# EAGLE design gatorBytes_LED_board (EAGLE 9.1.0)
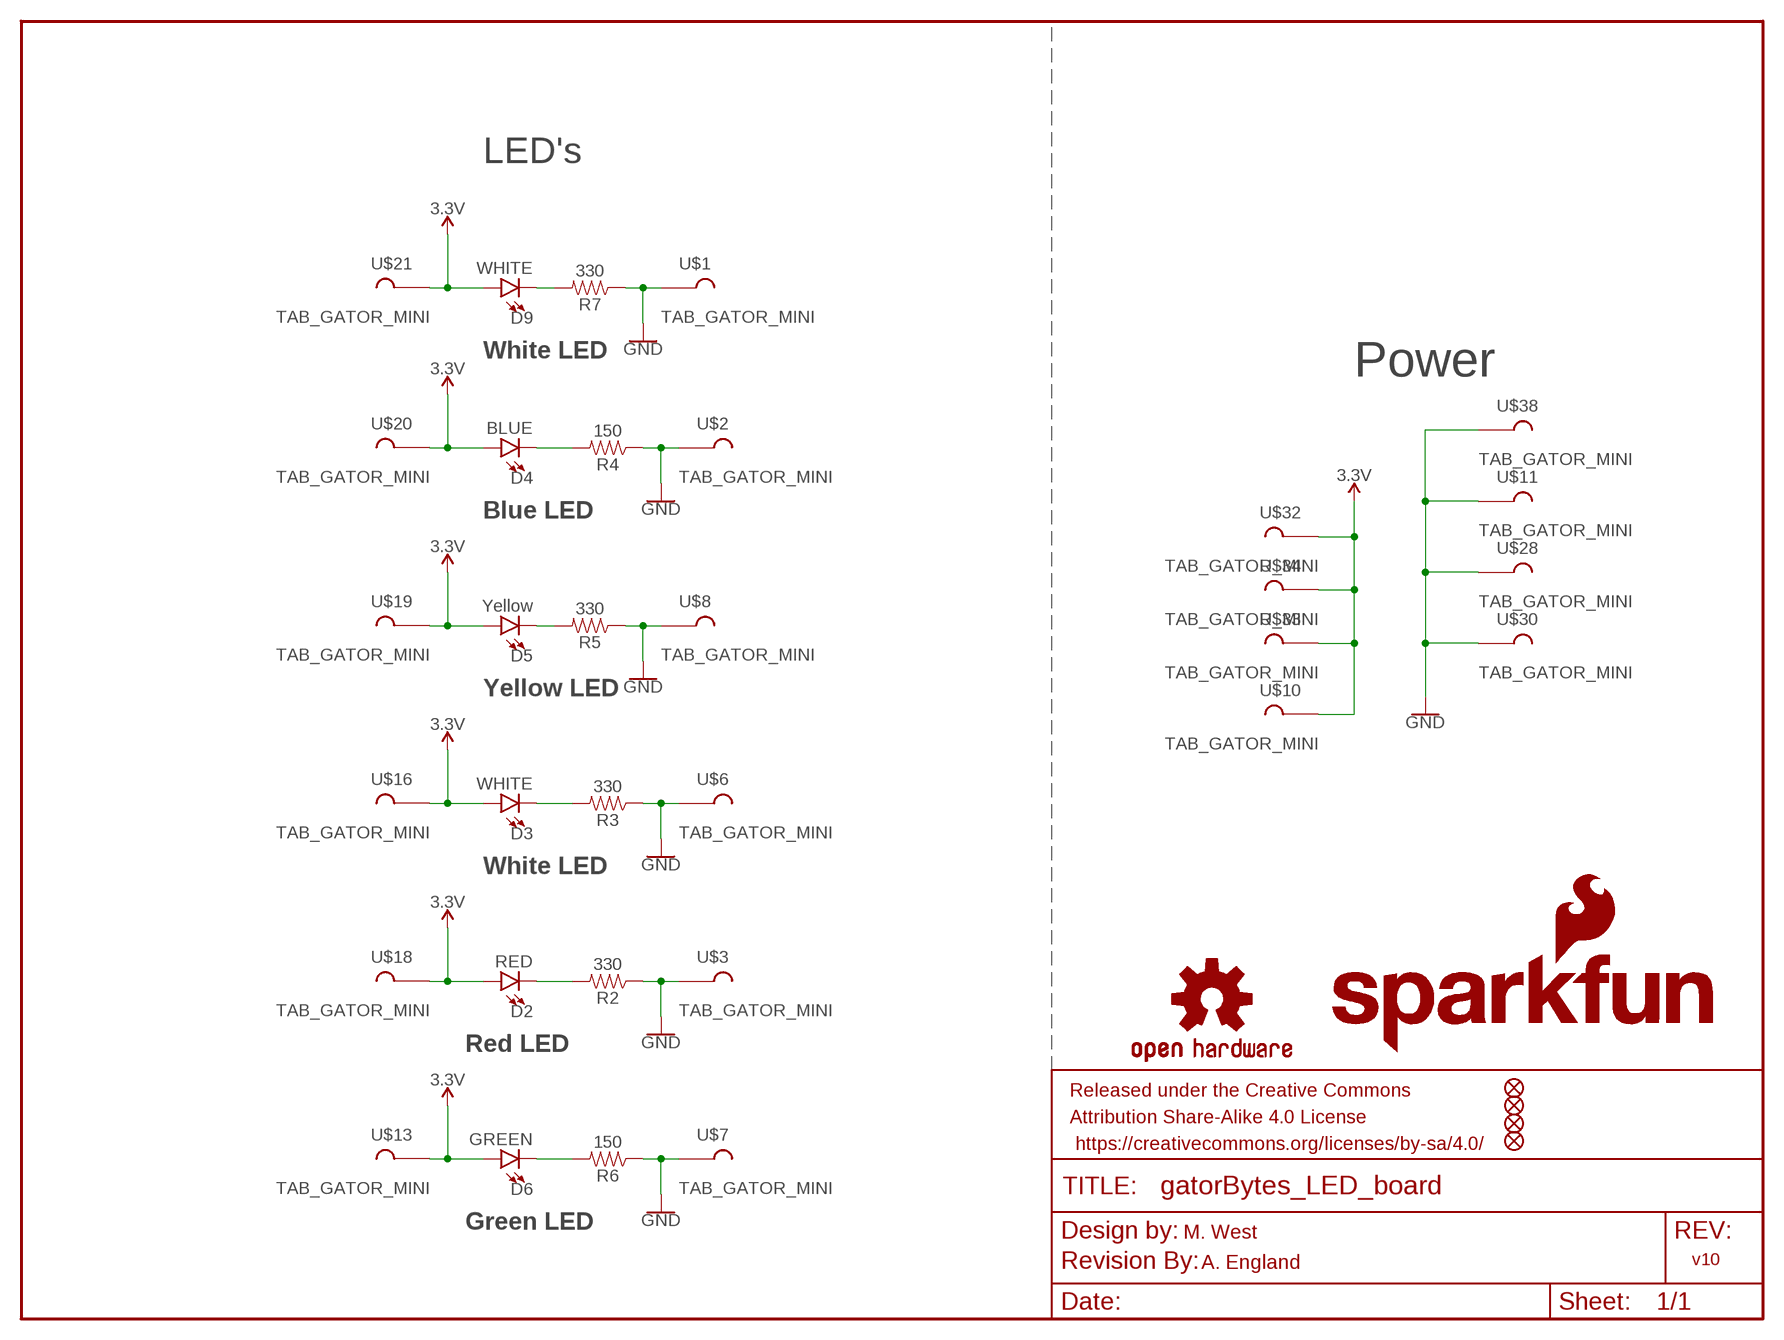
[diagram p0: schematic, sheet 1]

## Parts
D2  RED  LED-RED1206  [LED-1206]
D3  WHITE  LED-WHITE1206  [LED-1206]
D4  BLUE  LED-BLUE1206  [LED-1206]
D5  Yellow  LED-YELLOWLILYPAD  [LED-1206]
D6  GREEN  LED-GREEN1206  [LED-1206]
D9  WHITE  LED-WHITE1206  [LED-1206]
FD1  FIDUCIALUFIDUCIAL  [FIDUCIAL-MICRO]
FD2  FIDUCIALUFIDUCIAL  [FIDUCIAL-MICRO]
FD3  FIDUCIALUFIDUCIAL  [FIDUCIAL-MICRO]
FD4  FIDUCIALUFIDUCIAL  [FIDUCIAL-MICRO]
FRAME1  FRAME-LETTER  [CREATIVE_COMMONS]
LOGO1  SFE_LOGO_FLAME.1_INCH  [SFE_LOGO_FLAME_.1]
LOGO2  OSHW-LOGOMINI  [OSHW-LOGO-MINI]
LOGO8  REVISION  [REVISION]
LOGO15  OSHW-LOGOMINI  [OSHW-LOGO-MINI]
LOGO16  SFE_LOGO_NAME.1_INCH  [SFE_LOGO_NAME_.1]
R2  330  330OHM-0603-1/10W-1%  [0603]
R3  330  330OHM-0603-1/10W-1%  [0603]
R4  150  150OHM-0603-1/10W-1%  [0603]
R5  330  330OHM-0603-1/10W-1%  [0603]
R6  150  150OHM-0603-1/10W-1%  [0603]
R7  330  330OHM-0603-1/10W-1%  [0603]
U$1  TAB_GATOR_MINI  [TAB_GATOR_MINI]
U$2  TAB_GATOR_MINI  [TAB_GATOR_MINI]
U$3  TAB_GATOR_MINI  [TAB_GATOR_MINI]
U$6  TAB_GATOR_MINI  [TAB_GATOR_MINI]
U$7  TAB_GATOR_MINI  [TAB_GATOR_MINI]
U$8  TAB_GATOR_MINI  [TAB_GATOR_MINI]
U$10  TAB_GATOR_MINI  [TAB_GATOR_MINI]
U$11  TAB_GATOR_MINI  [TAB_GATOR_MINI]
U$13  TAB_GATOR_MINI  [TAB_GATOR_MINI]
U$16  TAB_GATOR_MINI  [TAB_GATOR_MINI]
U$18  TAB_GATOR_MINI  [TAB_GATOR_MINI]
U$19  TAB_GATOR_MINI  [TAB_GATOR_MINI]
U$20  TAB_GATOR_MINI  [TAB_GATOR_MINI]
U$21  TAB_GATOR_MINI  [TAB_GATOR_MINI]
U$28  TAB_GATOR_MINI  [TAB_GATOR_MINI]
U$30  TAB_GATOR_MINI  [TAB_GATOR_MINI]
U$32  TAB_GATOR_MINI  [TAB_GATOR_MINI]
U$33  TAB_GATOR_MINI  [TAB_GATOR_MINI]
U$34  TAB_GATOR_MINI  [TAB_GATOR_MINI]
U$38  TAB_GATOR_MINI  [TAB_GATOR_MINI]

## Nets
3.3V: D2.A D3.A D4.A D5.A D6.A D9.A U$10.P1 U$13.P1 U$16.P1 U$18.P1 U$19.P1 U$20.P1 U$21.P1 U$32.P1 U$33.P1 U$34.P1
GND: R2.1 R3.1 R4.1 R5.1 R6.1 R7.1 U$1.P1 U$2.P1 U$3.P1 U$6.P1 U$7.P1 U$8.P1 U$11.P1 U$28.P1 U$30.P1 U$38.P1
N$1: D2.C R2.2
N$3: D3.C R3.2
N$4: D4.C R4.2
N$5: D5.C R5.2
N$6: D6.C R6.2
N$7: D9.C R7.2

## Notes on the sheet
- LED's
- White LED
- Power
- Blue LED
- Yellow LED
- White LED
- Red LED
- Green LED
- M. West
- A. England | v10

## Library data of the parts
D2 = SparkFun-LED:LED-RED: Red SMD LED Used in manufacturing of most products at SparkFun Packages: 0603 - SMD 0603 package [Product Link] <http://docs.avagotech.com/docs/AV02-0551EN> 0603 SMART - SMD 0603 SMART package ( more efficient and expensive)[Product Link] <http://www.osram-os.com/Graphics/XPic2/00077099_0.pdf> 1206 - SMD1206 package [Product Link] <https://www.sparkfun.com/datasheets/DevTools/LilyPad/Q150OVS4.pdff> SparkFun Products: Pro Mini 328 -5V <https://www.sparkfun.com/products/821> RedBoard <https://www.sparkfun.com/products/12757> IOIO-OTG <https://www.sparkfun.com/products/13613>; PROD_ID: DIO-09912
D3 D9 = SparkFun-LED:LED-WHITE: White SMD LED Used in manufacturing several products at SparkFun. Packages: 0603 - Bright White SMD 0603 package[Product Link] <http://www.kingbrightusa.com/product.asp?catalog_name=LED&product_id=APT1608QWF/D> 1206 - Bright White SMD1206 package [Product Link] <http://www.kingbrightusa.com/product.asp?catalog_name=LED&product_id=APT3216QWF/D> 3014 - Super Bright SMD 3014 package [Datasheet] <http://www.lumileds.com/uploads/459/DS208-pdf> SparkFun Products: Blackberry Trackballer Breakout <https://www.sparkfun.com/products/13169> Digital SandBox <https://www.sparkfun.com/products/12651>; PROD_ID: DIO-09955
D4 = SparkFun-LED:LED-BLUE: Blue SMD LED Used in manufacturing of various products at SparkFun Packages: 0603 - SMD 0603 package [Product Link] <http://www.digikey.com/product-detail/en/SMLE12BC7TT86/511-1589-2-ND/1641808> 1206 - SMD1206 package [Product Link] <http://www.digikey.com/product-detail/en/lite-on-inc/LTST-C150TBKT/160-1643-1-ND/573584> SparkFun Products: ESP8266 Thing-Dev Board <https://www.sparkfun.com/products/13711> RedBoard <https://www.sparkfun.com/products/12757>; PROD_ID: DIO-09911
D5 = SparkFun-LED:LED-YELLOW: Yellow SMD LED Used in manufacturing several products at SparkFun. Packages: 0603 - SMD 0603 package[Product Link] <http://www.kingbrightusa.com/product.asp?catalog_name=LED&product_id=APT1608SYCK> 0603 -SMART - SMART SMD 0603 package (more efficient/more expensive) [Product Link] <http://www.osram-os.com/osram_os/en/products/product-catalog/led-light-emitting-diodes/smartled-0603/ly-l29k/index.jsp> LilyPad - SMD1206 package[Product Datasheet] <https://www.sparkfun.com/datasheets/DevTools/LilyPad/Q150YUS4.pdf> SparkFun Products: Blynk Board <https://www.sparkfun.com/products/13794> IOIO-OTG <https://www.sparkfun.com/products/13613> XBee Explorer Serial <https://www.sparkfun.com/products/13225>; PROD_ID: DIO-09909
D6 = SparkFun-LED:LED-GREEN: Green SMD LED Used in manufacturing of various products at SparkFun Packages: 0603 - SMD 0603 package [Product Link] <http://www.futureelectronics.com/en/technologies/semiconductors/optoelectronics/leds/Pages/9894312-LTST-C190GKT.aspx?CrossPart=HSMG-C190&IM=0> LilyPad 1206 - SMD1206 LilyPad package [Product Link] <http://www.futureelectronics.com/en/Technologies/Product.aspx?ProductID=IN150NGHARVATEKCORPORATION2049943&IM=0> 1206 - SMD1206 package [Product Link] <http://www.futureelectronics.com/en/technologies/semiconductors/optoelectronics/leds/Pages/8315665-LTST-C150KGKT.aspx?IM=0> 1206 Bottom Mount -SMD 1206 Bottom Mount [Product Link] <http://www.digikey.com/product-detail/en/lite-on-inc/LTST-C230KGKT/160-1456-1-ND/386854> SparkFun Products: Pro Mini 328 -5V <https://www.sparkfun.com/products/821> RedBoard <https://www.sparkfun.com/products/12757> MP3 Trigger <https://www.sparkfun.com/products/13720> Makey Makey <https://www.sparkfun.com/products/11076>; PROD_ID: DIO-00862
FD1-FD4 = SparkFun-Aesthetics:FIDUCIAL: Fiducial Alignment Points Point-of-reference for pick-and-place machines and other optical instruments.
FRAME1 = SparkFun-Aesthetics:FRAME-LETTER: Schematic Frame - Letter Standard 8.5x11 US Letter frame
LOGO1 = SparkFun-Aesthetics:SFE_LOGO_FLAME: SparkFun Flame Logo This is the SparkFun flame logo. The logo on the schematic will always be the same size; the package variant is the height of the flame. Default layer for the logo on the board is tSilk.
LOGO2 LOGO15 = SparkFun-Aesthetics:OSHW-LOGO: Open-Source Hardware (OSHW) Logo This logo indicates the piece of hardware it is found on incorporates a OSHW license and/or adheres to the definition of open source hardware found here: http://freedomdefined.org/OSHW
LOGO8 = SparkFun-Aesthetics:REVISION: "Revision By" Text Preceding text for revisor documentation. Includes schematic text on "symbols" layer, and board text on tDoc.
LOGO16 = SparkFun-Aesthetics:SFE_LOGO_NAME: SparkFun Font Logo This is the SparkFun name logo. The logo on the schematic will always be the same size; the package variant is the height of the flame part of the logo (or the height the flame would be, if it were drawn). Default layer for the logo on the board is tSilk.
R2 R3 R5 R7 = SparkFun-Resistors:330OHM: 330Ω resistor A resistor is a passive two-terminal electrical component that implements electrical resistance as a circuit element. Resistors act to reduce current flow, and, at the same time, act to lower voltage levels within circuits. - Wikipedia; PROD_ID: RES-00818
R4 R6 = SparkFun-Resistors:150OHM: 150Ω resistor A resistor is a passive two-terminal electrical component that implements electrical resistance as a circuit element. Resistors act to reduce current flow, and, at the same time, act to lower voltage levels within circuits. - Wikipedia; PROD_ID: RES-11028
U$1-U$3 U$6-U$8 U$10 U$11 U$13 U$16 U$18-U$21 U$28 U$30 U$32-U$34 U$38 = SparkFun-Connectors:TAB_GATOR_MINI

## Board
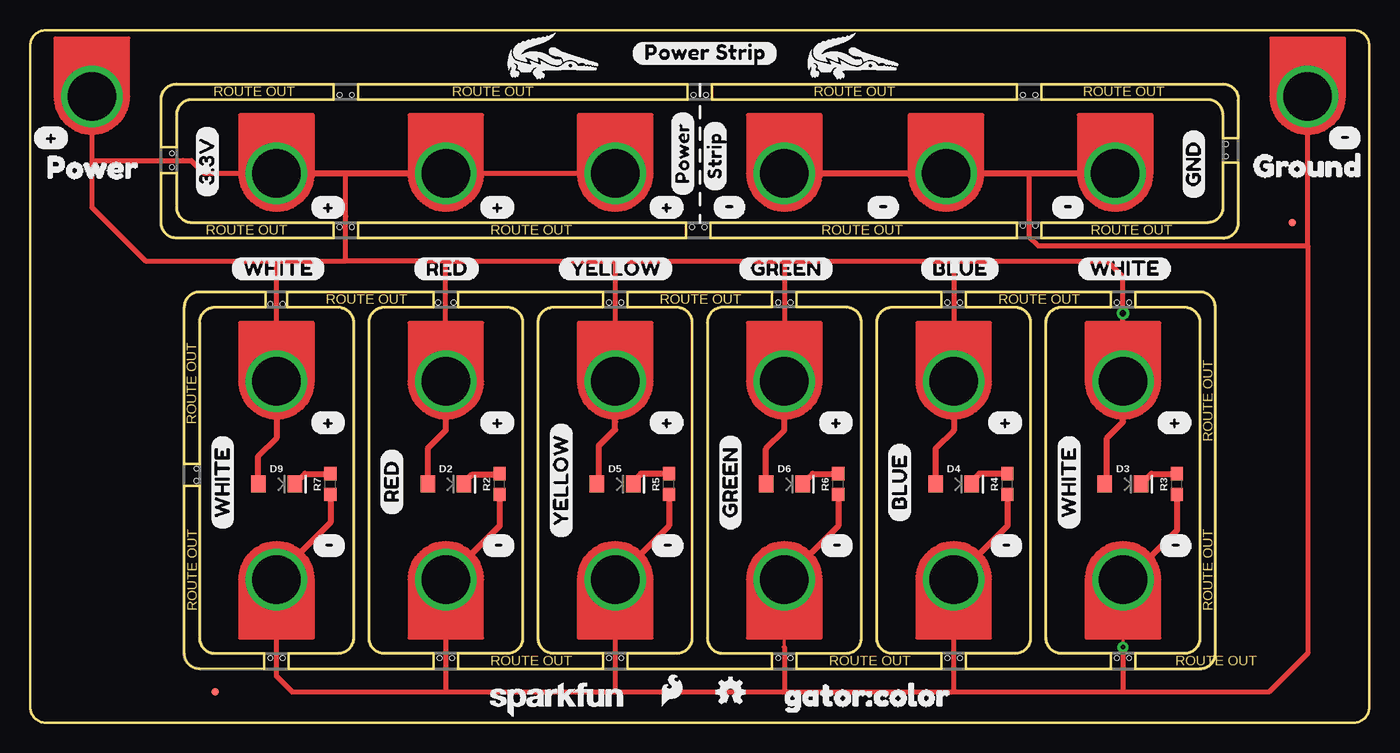
[diagram p1: board, top side]
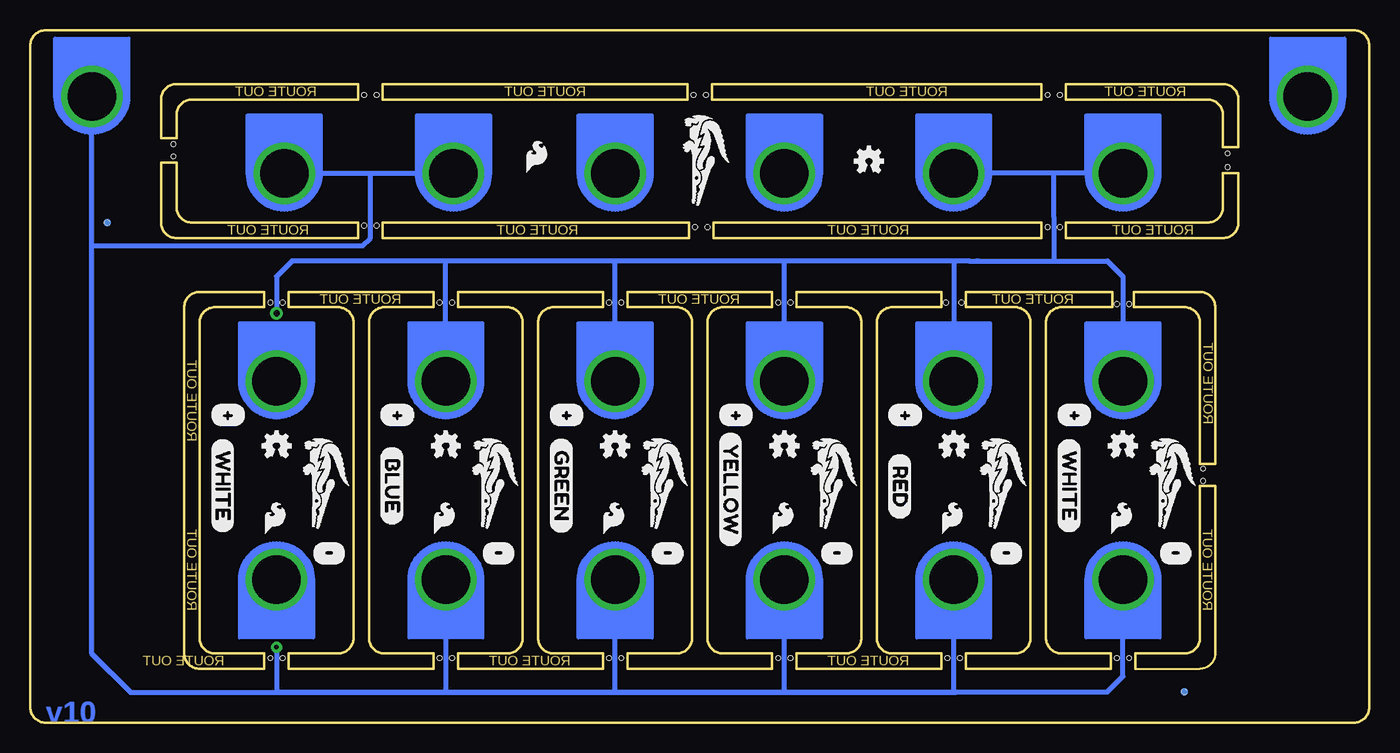
[diagram p2: board, bottom side, seen from below]

Size 110.49 x 57.15 mm. Coordinates in mm from the lower left corner, seen from the top.
Outline: 15.24,5.71 arc-90 13.97,6.99 13.97,19.56 12.7,19.56 12.7,5.71 arc90 13.97,4.45 19.3,4.45 19.3,5.71 15.24,5.71
Outline: 13.97,33.02 arc-90 15.24,34.29 19.43,34.29 19.43,35.56 13.97,35.56 arc90 12.7,34.29 12.7,21.34 13.97,21.34 13.97,33.02
Outline: 21.34,5.71 21.34,4.45 33.27,4.45 33.27,5.71 29.21,5.71 arc-90 27.94,6.99 27.94,33.02 arc-90 29.21,34.29 33.27,34.29 33.27,35.56 21.21,35.56 21.21,34.29 25.4,34.29 arc-90 26.67,33.02 26.67,6.99 arc-90 25.4,5.71 21.34,5.71
Outline: 0,1.27 0,55.88 arc-90 1.27,57.15 109.22,57.15 arc-90 110.49,55.88 110.49,1.27 arc-90 109.22,0 1.27,0 arc-90 0,1.27
Outline: 98.42,42.55 arc-90 97.16,41.27 83.44,41.27 83.44,40.01 98.42,40.01 arc90 99.69,41.27 99.69,46.23 98.42,46.23 98.42,42.55
Outline: 13.34,41.27 arc-90 12.06,42.55 12.06,45.34 10.79,45.34 10.79,41.27 arc90 12.06,40.01 25.02,40.01 25.02,41.27 13.34,41.27
Outline: 97.79,34.29 arc90 96.52,35.56 91.19,35.56 91.19,34.29 95.25,34.29 arc-90 96.52,33.02 96.52,6.99 arc-90 95.25,5.71 91.19,5.71 91.19,4.45 96.52,4.45 arc90 97.79,5.71 97.79,34.29
Outline: 35.31,5.71 35.31,4.45 47.24,4.45 47.24,5.71 43.18,5.71 arc-90 41.91,6.99 41.91,33.02 arc-90 43.18,34.29 47.24,34.29 47.24,35.56 35.31,35.56 35.31,34.29 39.37,34.29 arc-90 40.64,33.02 40.64,6.99 arc-90 39.37,5.71 35.31,5.71
Outline: 49.28,5.71 49.28,4.45 61.21,4.45 61.21,5.71 57.15,5.71 arc-90 55.88,6.99 55.88,33.02 arc-90 57.15,34.29 61.21,34.29 61.21,35.56 49.28,35.56 49.28,34.29 53.34,34.29 arc-90 54.61,33.02 54.61,6.99 arc-90 53.34,5.71 49.28,5.71
Outline: 63.25,5.71 63.25,4.45 75.18,4.45 75.18,5.71 71.12,5.71 arc-90 69.85,6.99 69.85,33.02 arc-90 71.12,34.29 75.18,34.29 75.18,35.56 63.25,35.56 63.25,34.29 67.31,34.29 arc-90 68.58,33.02 68.58,6.99 arc-90 67.31,5.71 63.25,5.71
Outline: 77.22,5.71 77.22,4.45 89.15,4.45 89.15,5.71 85.09,5.71 arc-90 83.82,6.99 83.82,33.02 arc-90 85.09,34.29 89.15,34.29 89.15,35.56 77.22,35.56 77.22,34.29 81.28,34.29 arc-90 82.55,33.02 82.55,6.99 arc-90 81.28,5.71 77.22,5.71
Outline: 27.05,41.27 27.05,40.01 54.1,40.01 54.1,41.27 27.05,41.27
Outline: 56.13,41.27 56.13,40.01 81.41,40.01 81.41,41.27 56.13,41.27
Outline: 10.79,47.5 12.06,47.5 12.06,50.16 arc-90 13.34,51.44 25.02,51.44 25.02,52.7 12.06,52.7 arc90 10.79,51.44 10.79,47.5
Outline: 27.05,51.44 27.05,52.7 54.23,52.7 54.23,51.44 27.05,51.44
Outline: 56.26,51.44 56.26,52.7 81.41,52.7 81.41,51.44 56.26,51.44
Outline: 83.44,51.44 83.44,52.7 98.42,52.7 arc-90 99.69,51.44 99.69,48.26 98.42,48.26 98.42,50.16 arc90 97.16,51.44 83.44,51.44
Copper layers (1*16): Top 0.035mm / dielectric 1.5mm / Bottom 0.035mm
Design rules "SparkFun-2-layer-STANDARD": minimum track width 10mil, minimum drill 20mil, track to track 10mil, track to pad 8mil, pad to pad 8mil, via to via 10mil, smd to smd 8mil, copper to edge 8mil, drill to drill 8mil, minimum pad ring 10mil, minimum via ring 10mil, stop-mask expansion 4mil, vias tented up to drill 25mil, thermal gap 10mil
Holes 0.38 mm at 25.53,40.89 54.74,51.82 26.54,40.89 54.61,40.89 81.92,41.02 55.63,40.89 82.93,41.02 98.68,47.75 98.68,46.74 19.81,34.54 20.83,34.54 33.66,34.67 34.92,34.67 47.75,34.67 48.77,34.67 61.72,34.67 62.74,34.67 75.69,34.67 76.71,34.67 89.66,34.67 90.68,34.67 89.66,5.33 90.68,5.33 75.69,5.33 76.71,5.33 61.72,5.33 62.74,5.33 47.75,5.33 48.77,5.33 33.78,5.33 34.8,5.33 19.81,5.33 20.83,5.33 13.72,20.95 13.72,19.94 11.68,45.85 11.68,46.99 55.75,51.82 25.53,51.82 26.54,51.82 81.92,51.82 82.93,51.82

### Footprints (pad centres in the part's own frame; a part is rotated, then mirrored left to right if it is on the bottom)
LED-1206 = smd 1.2 x 1.4: A -1.5,0; C 1.5,0
FIDUCIAL-MICRO = smd 0.635 x 0.635: 1 0,0
0603 = smd 1.1 x 1: 1 -0.85,0; 2 0.85,0
TAB_GATOR_MINI = drill 4 pad 5.08: P1 0,4.826

### Placement (x,y rotation side)
D2  34.29,19.68 0 top
D3  90.17,19.68 0 top
D4  76.2,19.68 0 top
D5  48.26,19.68 0 top
D6  62.23,19.68 0 top
D9  20.32,19.68 0 top
FD1  15.24,2.54 0 top
FD2  15.24,2.54 0 bottom
FD3  104.14,41.27 0 top
FD4  104.14,41.27 0 bottom
FRAME1  22.23,-8.89 0 top  (outside the outline)
LOGO1  21.59,15.24 0 bottom
LOGO2  20.32,22.86 0 bottom
LOGO3  OSHW-LOGOMINI  [OSHW-LOGO-MINI]  34.29,22.86 0 bottom
LOGO4  OSHW-LOGOMINI  [OSHW-LOGO-MINI]  48.26,22.86 0 bottom
LOGO5  OSHW-LOGOMINI  [OSHW-LOGO-MINI]  62.23,22.86 0 bottom
LOGO6  OSHW-LOGOMINI  [OSHW-LOGO-MINI]  76.2,22.86 0 bottom
LOGO7  OSHW-LOGOMINI  [OSHW-LOGO-MINI]  90.17,22.86 0 bottom
LOGO8  33.66,-11.43 0 top  (outside the outline)
LOGO9  SFE_LOGO_FLAME.1_INCH  [SFE_LOGO_FLAME_.1]  35.56,15.24 0 bottom
LOGO10  SFE_LOGO_FLAME.1_INCH  [SFE_LOGO_FLAME_.1]  49.53,15.24 0 bottom
LOGO11  SFE_LOGO_FLAME.1_INCH  [SFE_LOGO_FLAME_.1]  63.5,15.24 0 bottom
LOGO12  SFE_LOGO_FLAME.1_INCH  [SFE_LOGO_FLAME_.1]  77.47,15.24 0 bottom
LOGO13  SFE_LOGO_FLAME.1_INCH  [SFE_LOGO_FLAME_.1]  91.44,15.24 0 bottom
LOGO15  57.78,2.54 0 top
LOGO16  37.47,0 0 top
LOGO17  SFE_LOGO_FLAME.1_INCH  [SFE_LOGO_FLAME_.1]  51.82,1.02 0 top
LOGO18  OSHW-LOGOMINI  [OSHW-LOGO-MINI]  41.27,46.35 0 bottom
LOGO19  SFE_LOGO_FLAME.1_INCH  [SFE_LOGO_FLAME_.1]  69.85,45.09 0 bottom
R2  38.73,19.68 90 top
R3  94.61,19.68 90 top
R4  80.64,19.68 90 top
R5  52.7,19.68 90 top
R6  66.67,19.68 90 top
R7  24.77,19.68 90 top
U$1  76.2,6.99 0 top
U$2  20.32,6.99 0 top
U$3  34.29,6.99 0 top
U$4  [ORDERING_INSTRUCTIONS]  3.17,-12.06 0 top  (outside the outline)
U$5  [POWER_STRIP0]  49.66,55.24 0 top
U$6  90.17,6.99 0 top
U$7  62.23,6.99 0 top
U$8  48.26,6.99 0 top
U$9  [GROUND3]  99.31,45.97 0 top
U$10  48.26,50.16 180 top
U$11  89.53,50.16 180 top
U$12  [#8]  26.04,42.55 180 top
U$13  48.26,33.02 180 top
U$14  [#8]  40.01,42.55 180 top
U$15  [#8]  53.98,42.55 180 top
U$16  62.23,33.02 180 top
U$17  [RED2]  38.73,22.23 270 bottom
U$18  34.29,33.02 180 top
U$19  90.17,33.02 180 top
U$20  76.2,33.02 180 top
U$21  20.32,50.16 180 top
U$22  [#9]  59.05,42.55 180 top
U$23  [#9]  71.75,42.55 180 top
U$24  [#9]  87,42.55 180 top
U$25  [3#3V1]  14.61,43.31 90 top
U$26  [GND0]  96.01,43.18 90 top
U$27  [POWER1]  53.85,43.43 90 top
U$28  75.56,50.16 180 top
U$29  [GATOR#PNG]  54.61,46.74 270 bottom
U$30  62.23,50.16 180 top
U$31  [GATOR#PNG]  67.56,55.12 0 top
U$32  5.08,56.52 180 top
U$33  20.32,33.02 180 top
U$34  34.29,50.16 180 top
U$35  [STRIP2]  56.52,43.81 90 top
U$36  [BLUE4]  73.41,37.47 0 top
U$37  [BLUE4]  71.75,16.51 90 top
U$38  105.41,56.52 180 top
U$39  [GREEN3]  58.42,37.47 0 top
U$40  [GREEN3]  57.78,15.88 90 top
U$41  [RED2]  31.62,37.47 0 top
U$42  [RED2]  29.84,17.14 90 top
U$43  [POWER2]  -0.25,45.85 0 top
U$44  [WHITE6]  86.36,37.47 0 top
U$45  [WHITE6]  16.51,37.47 0 top
U$46  [WHITE6]  85.72,15.88 90 top
U$47  [WHITE6]  15.88,15.88 90 top
U$48  [YELLOW5]  43.56,37.47 0 top
U$49  [YELLOW5]  43.81,15.24 90 top
U$50  [GATOR#PNG]  42.8,55.12 0 top
U$51  [GATOR#COLOR0]  60.58,2.29 0 top
U$53  [#8]  95.89,24.77 180 top
U$54  [#9]  95.89,14.61 180 top
U$55  [#8]  81.92,24.77 180 top
U$56  [#9]  81.92,14.61 180 top
U$57  [#8]  67.94,24.77 180 top
U$58  [#9]  67.94,14.61 180 top
U$60  [#8]  53.98,24.77 180 top
U$61  [#9]  53.98,14.61 180 top
U$62  [#8]  40.01,24.77 180 top
U$63  [#9]  40.01,14.61 180 top
U$64  [#8]  26.04,24.77 180 top
U$65  [#9]  26.04,14.61 180 top
U$67  [GREEN3]  66.67,23.5 270 bottom
U$68  [GATOR#PNG]  16.13,20.07 270 bottom
U$69  [GATOR#PNG]  30.1,20.07 270 bottom
U$70  [GATOR#PNG]  44.07,20.07 270 bottom
U$71  [GATOR#PNG]  58.04,20.07 270 bottom
U$72  [GATOR#PNG]  72.01,20.07 270 bottom
U$73  [GATOR#PNG]  85.98,20.07 270 bottom
U$75  [BLUE4]  80.64,22.86 270 bottom
U$76  [YELLOW5]  52.7,24 270 bottom
U$77  [#8]  3.17,48.26 180 top
U$78  [WHITE6]  94.61,23.5 270 bottom
U$79  [WHITE6]  24.77,23.5 270 bottom
U$81  [#8]  22.86,25.4 180 bottom
U$82  [#9]  14.61,13.97 180 bottom
U$83  [#8]  36.83,25.4 180 bottom
U$84  [#8]  50.8,25.4 180 bottom
U$85  [#8]  64.77,25.4 180 bottom
U$86  [#8]  78.74,25.4 180 bottom
U$87  [#8]  92.71,25.4 180 bottom
U$89  [#9]  28.57,13.97 180 bottom
U$90  [#9]  42.55,13.97 180 bottom
U$91  [#9]  56.52,13.97 180 bottom
U$92  [#9]  70.48,13.97 180 bottom
U$93  [#9]  84.45,13.97 180 bottom
U$95  [#9]  109.86,48.26 180 top

### Tracks (layer width: path | path; a pad name or v marks a point on that pad's centre or on a via)
3.3V  (via drill 0.51)
  Top 0.254: 13.28,46.41 13.34,46.35 | U$20.P1 76.2,27.94 76.2,27.3
  Top 0.406: 20.32,38.1 9.53,38.1 5.08,42.55 5.08,46.35 5.08,46.41 | 20.32,38.1 26.04,38.1 | 34.29,38.1 48.26,38.1 | 48.26,38.1 62.23,38.1 | 34.29,38.1 26.04,38.1 | 26.04,45.34 26.04,41.78 26.04,38.1 | U$34.P1 U$10.P1 | 14.35,45.34 U$21.P1 | 14.35,45.34 13.34,46.35 14.35,45.34 | U$32.P1 5.08,46.41 | 5.08,46.41 12.61,46.41 13.28,46.41 | 76.2,38.1 88.9,38.1 90.17,36.83 v90.17,33.78 U$19.P1 | 62.23,38.1 76.2,38.1 | D9.A 18.99,19.68 | D5.A 46.93,19.68 | D3.A 88.84,19.68 | D4.A 74.9,19.68 | U$33.P1 20.32,31.11 | 20.32,31.11 20.32,32.38 | 20.32,31.11 20.32,38.1 | 76.2,38.1 76.2,27.94 | 48.26,38.1 U$13.P1 | 62.23,38.1 62.23,27.3 | U$18.P1 34.29,38.1
  Top 0.508: U$21.P1 26.04,45.34 U$34.P1 | 46.93,19.68 46.93,22.86 48.26,24.19 48.26,24.82 | U$16.P1 62.23,27.3 62.23,24.13 60.73,22.63 D6.A | 76.2,27.3 76.2,24.13 74.7,22.63 D4.A | 88.84,19.68 88.84,23.5 90.17,24.82 | D9.A 18.82,22 20.32,23.5 20.32,27.3 U$33.P1 | U$18.P1 34.29,24.82 | 48.26,24.82 U$13.P1 | 90.17,24.82 U$19.P1 90.17,24.82 | 48.26,24.82 U$13.P1 | U$13.P1 | 34.29,24.82 | 34.29,24.82 34.29,24.13 32.79,22.63 D2.A | U$18.P1
  Bottom 0.406: 26.04,38.1 32.26,38.1 32.38,38.1 33.02,38.1 34.29,38.1 | 26.04,38.1 21.59,38.1 20.32,36.83 U$33.P1 | 34.29,38.1 48.26,38.1 | 48.26,38.1 62.23,38.1 | 62.23,38.1 76.2,38.1 | U$21.P1 26.04,45.34 | 26.04,45.34 U$34.P1 | 76.2,38.1 88.9,38.1 90.17,36.83 v90.17,33.78 | 26.04,41.78 | 26.04,41.78 26.04,38.1 | U$20.P1 76.2,38.1 | U$13.P1 48.26,38.1 | U$16.P1 62.23,38.1 | 34.29,38.1 U$18.P1 | 26.04,41.78 26.04,45.34
GND  (via drill 0.38)
  Top 0.254: 20.32,14.39 20.32,12.06 U$2.P1 | U$6.P1 90.17,11.43 v90.17,6.22 | U$2.P1 | 62.23,6.22 U$7.P1 62.23,6.22
  Top 0.406: 34.29,2.54 21.59,2.54 20.32,3.81 U$2.P1 | 34.29,2.54 48.26,2.54 | 48.26,2.54 62.23,2.54 | 62.23,2.54 76.2,2.54 | 76.2,2.54 90.17,2.54 | 90.17,2.54 102.23,2.54 105.41,5.71 105.41,39.37 | v90.17,6.22 90.17,2.54 | 62.23,2.54 62.23,6.22 62.23,2.54 | 34.29,6.22 | 34.29,6.22 34.29,2.54 | 82.55,45.34 82.42,45.21 82.42,41.78 82.42,40.13 83.19,39.37 105.41,39.37 | 105.41,39.37 U$38.P1 | 76.2,2.54 U$1.P1 | U$8.P1 48.26,2.54 | U$3.P1 34.29,6.22
  Top 0.508: U$30.P1 U$28.P1 82.55,45.34 U$11.P1 | R7.1 24.77,16.51 20.32,12.06 | 38.73,16.26 U$3.P1 | 52.7,16.26 U$8.P1 | R3.1 94.61,15.88 90.17,11.43 | U$7.P1 63.5,13.08 U$7.P1 | 80.64,16.26 U$1.P1 | U$7.P1 66.67,16.26 | 80.64,16.26 U$1.P1 | 52.7,16.26 U$8.P1 | 38.73,16.26 U$3.P1 | 80.64,16.26 U$1.P1 | U$1.P1 80.64,16.26 | 80.64,16.26 | 52.7,16.26 | 38.73,16.26 | 38.73,16.26 U$3.P1 | 52.7,16.26 U$8.P1 | 52.7,16.26 U$8.P1 | 38.73,16.26 U$3.P1 | 38.73,16.26 U$3.P1 | 38.73,16.26 U$3.P1 | 52.7,16.26 | 80.64,16.26 U$1.P1 | 52.7,16.26 U$8.P1 | 52.7,16.26 U$8.P1 | 80.64,16.26 U$1.P1 | U$7.P1 66.67,16.26 | 38.73,16.26 U$3.P1 | 52.7,16.26 U$8.P1 | R4.1 80.64,16.26 | R6.1 66.67,16.26 | R5.1 52.7,16.26 | R2.1 38.73,16.26
  Bottom 0.406: 34.14,2.49 102.21,2.49 105.41,5.69 105.41,39.37 | 34.29,2.54 21.59,2.54 20.32,3.81 U$2.P1 | v90.17,6.22 90.17,2.54 76.2,2.54 | 82.42,45.34 82.42,41.78 82.42,40.01 | 82.42,45.34 U$28.P1 | 105.41,39.37 83.06,39.37 | 48.26,2.54 34.29,2.54 | 62.23,2.54 48.26,2.54 | 76.2,2.54 62.23,2.54 | U$11.P1 82.42,45.34 | 83.06,39.37 82.42,40.01 | 105.41,39.37 83.06,39.37 | 83.06,39.37 82.42,40.01 | 105.41,39.37 | 105.41,39.37 U$38.P1 | 105.41,39.37 | U$1.P1 76.2,2.54 | 48.26,2.54 U$8.P1 | 34.29,2.54 U$3.P1 | 62.23,2.54 62.23,6.99
N$1
  Top 0.508: R2.2 38.68,20.48 36.47,20.48 35.73,19.74 D2.C
N$3
  Top 0.508: D3.C 92.52,20.54 R3.2
N$4
  Top 0.406: D4.C 77.61,19.77
  Top 0.508: R4.2 78.32,20.54 77.7,19.91 D4.C
N$5
  Top 0.508: R5.2 50.38,20.54 49.76,19.91 D5.C
N$6
  Top 0.406: D6.C 63.64,19.77
  Top 0.508: D6.C 64.58,20.54 R6.2
N$7
  Top 0.508: D9.C 22.67,20.54 R7.2

### Text on the board
Bottom: v10
Dimension: ROUTE OUT | ROUTE OUT | ROUTE OUT | ROUTE OUT | ROUTE OUT | ROUTE OUT | ROUTE OUT | ROUTE OUT | ROUTE OUT | ROUTE OUT | ROUTE OUT | ROUTE OUT | ROUTE OUT | ROUTE OUT | ROUTE OUT | ROUTE OUT | ROUTE OUT | ROUTE OUT
tDocu: M. West | A. England | Black Gloss PCB